# Altium schematic sheet sonar_DAQ_old.SchDoc
size A4
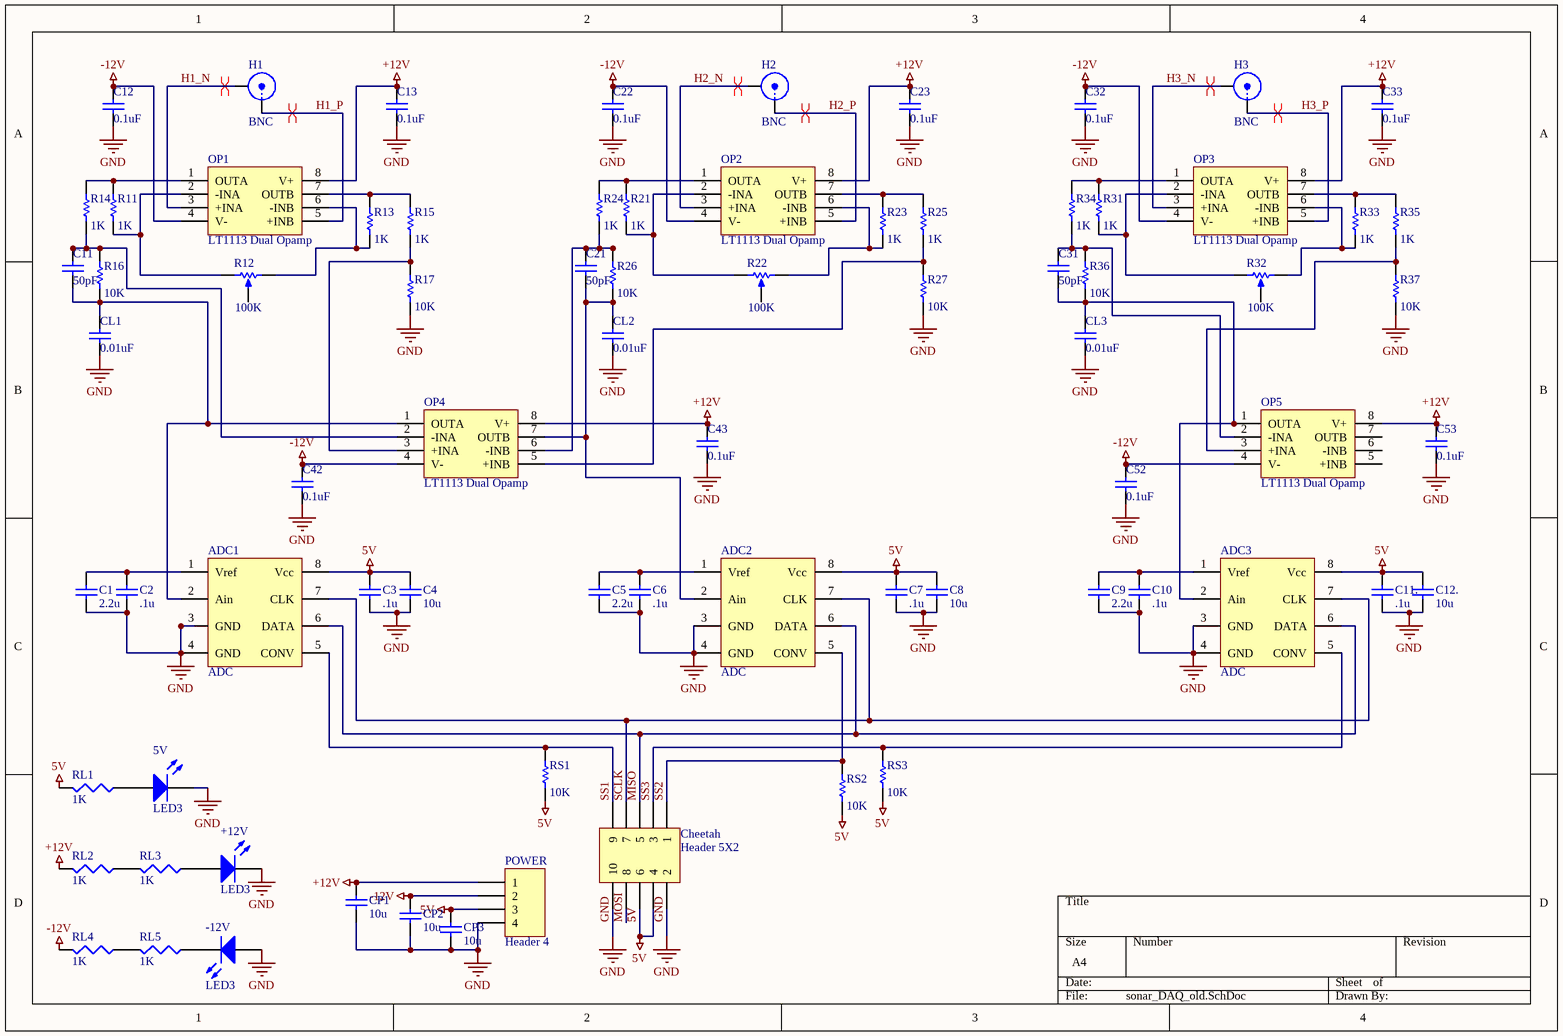
[diagram p0: sonar_DAQ_old.SchDoc]

## Parts
5V  LED3  [0805_led]
+12V  LED3  [0805_led]
-12V  LED3  [0805_led]
ADC1  ADC  [ADC]
ADC2  ADC  [ADC]
ADC3  ADC  [ADC]
C1  2.2u  [0805_tantalum_cap]
C2  .1u  [0805_ceramic_cap]
C3  .1u  [0805_ceramic_cap]
C4  10u  [0805_tantalum_cap]
C5  2.2u  [0805_tantalum_cap]
C6  .1u  [0805_ceramic_cap]
C7  .1u  [0805_ceramic_cap]
C8  10u  [0805_tantalum_cap]
C9  2.2u  [0805_tantalum_cap]
C10  .1u  [0805_ceramic_cap]
C11  value 50pF  [0805_ceramic_cap]  (hidden comment: Cap)
C11.  .1u  [0805_ceramic_cap]
C12  value 0.1uF  [0805_ceramic_cap]  (hidden comment: Cap)
C12.  10u  [0805_tantalum_cap]
C13  value 0.1uF  [0805_ceramic_cap]  (hidden comment: Cap)
C21  value 50pF  [0805_ceramic_cap]  (hidden comment: Cap)
C22  value 0.1uF  [0805_ceramic_cap]  (hidden comment: Cap)
C23  value 0.1uF  [0805_ceramic_cap]  (hidden comment: Cap)
C31  value 50pF  [0805_ceramic_cap]  (hidden comment: Cap)
C32  value 0.1uF  [0805_ceramic_cap]  (hidden comment: Cap)
C33  value 0.1uF  [0805_ceramic_cap]  (hidden comment: Cap)
C42  value 0.1uF  [0805_ceramic_cap]  (hidden comment: Cap)
C43  value 0.1uF  [0805_ceramic_cap]  (hidden comment: Cap)
C52  value 0.1uF  [0805_ceramic_cap]  (hidden comment: Cap)
C53  value 0.1uF  [0805_ceramic_cap]  (hidden comment: Cap)
Cheetah  Header 5X2  [HDR2X5]
CL1  value 0.01uF  [0805_ceramic_cap]  (hidden comment: Cap)
CL2  value 0.01uF  [0805_ceramic_cap]  (hidden comment: Cap)
CL3  value 0.01uF  [0805_ceramic_cap]  (hidden comment: Cap)
CP1  10u  [0805_tantalum_cap]
CP2  10u  [0805_tantalum_cap]
CP3  10u  [0805_tantalum_cap]
H1  BNC  [BNC]
H2  BNC  [BNC]
H3  BNC  [BNC]
OP1  LT1113 Dual Opamp  [lt1113_opamp]
OP2  LT1113 Dual Opamp  [lt1113_opamp]
OP3  LT1113 Dual Opamp  [lt1113_opamp]
OP4  LT1113 Dual Opamp  [lt1113_opamp]
OP5  LT1113 Dual Opamp  [lt1113_opamp]
POWER  Header 4  [HDR1X4]
R11  value 1K  [0805_res]  (hidden comment: Res1)
R12  value 100K  [trimmer_pot]  (hidden comment: RPot)
R13  value 1K  [0805_res]  (hidden comment: Res1)
R14  value 1K  [0805_res]  (hidden comment: Res1)
R15  value 1K  [0805_res]  (hidden comment: Res1)
R16  value 10K  [0805_res]  (hidden comment: Res1)
R17  value 10K  [0805_res]  (hidden comment: Res1)
R21  value 1K  [0805_res]  (hidden comment: Res1)
R22  value 100K  [trimmer_pot]  (hidden comment: RPot)
R23  value 1K  [0805_res]  (hidden comment: Res1)
R24  value 1K  [0805_res]  (hidden comment: Res1)
R25  value 1K  [0805_res]  (hidden comment: Res1)
R26  value 10K  [0805_res]  (hidden comment: Res1)
R27  value 10K  [0805_res]  (hidden comment: Res1)
R31  value 1K  [0805_res]  (hidden comment: Res1)
R32  value 100K  [trimmer_pot]  (hidden comment: RPot)
R33  value 1K  [0805_res]  (hidden comment: Res1)
R34  value 1K  [0805_res]  (hidden comment: Res1)
R35  value 1K  [0805_res]  (hidden comment: Res1)
R36  value 10K  [0805_res]  (hidden comment: Res1)
R37  value 10K  [0805_res]  (hidden comment: Res1)
RL1  value 1K  [0805_res]  (hidden comment: Res3)
RL2  value 1K  [0805_res]  (hidden comment: Res3)
RL3  value 1K  [0805_res]  (hidden comment: Res3)
RL4  value 1K  [0805_res]  (hidden comment: Res3)
RL5  value 1K  [0805_res]  (hidden comment: Res3)
RS1  value 10K  [0805_res]  (hidden comment: Res1)
RS2  value 10K  [0805_res]  (hidden comment: Res1)
RS3  value 10K  [0805_res]  (hidden comment: Res1)

## Nets
5V: ADC1.8(Vcc) ADC2.8(Vcc) ADC3.8(Vcc) C3.1 C4.1 C7.1 C8.1 C11..1 C12..1 Cheetah.4 Cheetah.6 CP3.1 POWER.3 RL1.2 RS1.1 RS2.1 RS3.1
+12V: C13.2 C23.2 C33.2 C43.2 C53.2 CP1.1 OP1.8(V+) OP2.8(V+) OP3.8(V+) OP4.8(V+) OP5.8(V+) POWER.1 RL2.2
-12V: C12.2 C22.2 C32.2 C42.2 C52.2 CP2.1 OP1.4(V-) OP2.4(V-) OP3.4(V-) OP4.4(V-) OP5.4(V-) POWER.2 RL4.2
GND: 5V.2(K) +12V.2(K) -12V.1(A) ADC1.3(GND) ADC1.4(GND) ADC2.3(GND) ADC2.4(GND) ADC3.3(GND) ADC3.4(GND) C1.2 C2.2 C3.2 C4.2 C5.2 C6.2 C7.2 C8.2 C9.2 C10.2 C11..2 C12.1 C12..2 C13.1 C22.1 C23.1 C32.1 C33.1 C42.1 C43.1 C52.1 C53.1 Cheetah.2 Cheetah.10 CL1.2 CL2.2 CL3.2 CP1.2 CP2.2 CP3.2 POWER.4 R17.1 R27.1 R37.1
H1_N: H1.2(Y) OP1.3(+INA)
H1_P: H1.1(X) OP1.5(+INB)
H2_N: H2.2(Y) OP2.3(+INA)
H2_P: H2.1(X) OP2.5(+INB)
H3_N: H3.2(Y) OP3.3(+INA)
H3_P: H3.1(X) OP3.5(+INB)
MISO: ADC1.6(DATA) ADC2.6(DATA) ADC3.6(DATA) Cheetah.5
MOSI: Cheetah.8
SCLK: ADC1.7(CLK) ADC2.7(CLK) ADC3.7(CLK) Cheetah.7
SS1: ADC1.5(CONV) Cheetah.9 RS1.2
SS2: ADC2.5(CONV) Cheetah.1 RS2.2
SS3: ADC3.5(CONV) Cheetah.3 RS3.2
Net5V_1: 5V.1(A) RL1.1
Net+12V_1: +12V.1(A) RL3.1
Net-12V_2: -12V.2(K) RL5.1
NetADC1_1: ADC1.1(Vref) C1.1 C2.1
NetADC1_2: ADC1.2(Ain) C11.1 CL1.1 OP4.1(OUTA) R16.1
NetADC2_1: ADC2.1(Vref) C5.1 C6.1
NetADC2_2: ADC2.2(Ain) C21.1 CL2.1 OP4.7(OUTB) R26.1
NetADC3_1: ADC3.1(Vref) C9.1 C10.1
NetADC3_2: ADC3.2(Ain) C31.1 CL3.1 OP5.1(OUTA) R36.1
NetC11_2: C11.2 OP4.2(-INA) R14.1 R16.2
NetC21_2: C21.2 OP4.6(-INB) R24.1 R26.2
NetC31_2: C31.2 OP5.2(-INA) R34.1 R36.2
NetOP1_1: OP1.1(OUTA) R11.2 R14.2
NetOP1_2: OP1.2(-INA) R11.1 R12.1(TOP)
NetOP1_6: OP1.6(-INB) R12.2(BOT) R13.1
NetOP1_7: OP1.7(OUTB) R13.2 R15.2
NetOP2_1: OP2.1(OUTA) R21.2 R24.2
NetOP2_2: OP2.2(-INA) R21.1 R22.1(TOP)
NetOP2_6: OP2.6(-INB) R22.2(BOT) R23.1
NetOP2_7: OP2.7(OUTB) R23.2 R25.2
NetOP3_1: OP3.1(OUTA) R31.2 R34.2
NetOP3_2: OP3.2(-INA) R31.1 R32.1(TOP)
NetOP3_6: OP3.6(-INB) R32.2(BOT) R33.1
NetOP3_7: OP3.7(OUTB) R33.2 R35.2
NetOP4_3: OP4.3(+INA) R15.1 R17.2
NetOP4_5: OP4.5(+INB) R25.1 R27.2
NetOP5_3: OP5.3(+INA) R35.1 R37.2
NetRL2_1: RL2.1 RL3.2
NetRL4_1: RL4.1 RL5.2

Not connected (* = marked no-connect by the designer): OP5 5(+INB) 6(-INB) 7(OUTB); R12 3(TAP); R22 3(TAP); R32 3(TAP)

## Layout directives
differential pair: H1_N, H1_P, H2_N, H2_P, H3_N, H3_P

## Library data of the parts
5V +12V -12V = LED3: Typical BLUE SiC LED; Published: 8-Jun-2000; LatestRevisionDate: 17-Dec-2003; LatestRevisionNote: PCB Footprint replaced.; DatasheetDocument: 16-Apr-2002; PackageDocument: 16-Apr-2002; PackageReference: 3.5X2.8X1.9; Publisher: Altium Limited
ADC1-ADC3 = ADC: ADS7835
C1-C11 C11. C12 C12. C13 C21-C23 C31-C33 C42 C43 C52 C53 CL1-CL3 CP1-CP3 = Cap: Capacitor; Published: 8-Jun-2000; LatestRevisionDate: 17-Jul-2002; LatestRevisionNote: Re-released for DXP Platform.; PackageReference: RAD-0.3; Publisher: Altium Limited
  C1-C10 C11. C12. CP1-CP3: PackageDescription: Radial Cap, Thru-Hole; 2 Leads; 0.3 in Pin Spacing
Cheetah = Header 5X2: Header, 5-Pin, Dual row; LatestRevisionDate: 17-Jul-2002; LatestRevisionNote: Re-released for DXP Platform.; Publisher: Altium Limited
H1-H3 = BNC: BNC Elbow Connector; LatestRevisionDate: 17-Jul-2002; LatestRevisionNote: Re-released for DXP Platform.; Publisher: Altium Limited
OP1-OP5 = LT1113 OPAMP
POWER = Header 4: Header, 4-Pin; LatestRevisionDate: 17-Jul-2002; LatestRevisionNote: Re-released for DXP Platform.; Publisher: Altium Limited
R11 R13-R17 R21 R23-R27 R31 R33-R37 RS1-RS3 = Res1: Resistor; Published: 8-Jun-2000; LatestRevisionDate: 17-Jul-2002; LatestRevisionNote: Re-released for DXP Platform.; PackageReference: AXIAL-0.3; Publisher: Altium Limited
R12 R22 R32 = RPot: Potentiometer; Sim Note: Enter the Resistance value and the set point into parameter fields.; Set Position: 0.5; Published: 8-Jun-2000; LatestRevisionDate: 17-Jul-2002; LatestRevisionNote: Re-released for DXP Platform.; PackageReference: VR5; Publisher: Altium Limited
RL1-RL5 = Res3: Resistor; Published: 8-Jun-2000; LatestRevisionDate: 04-Mar-2005; LatestRevisionNote: PCB Footprint replaced.; PackageReference: J1-0603; Publisher: Altium Limited